# EAGLE design board (EAGLE 9.6.2)
Assembly variants: Assembly
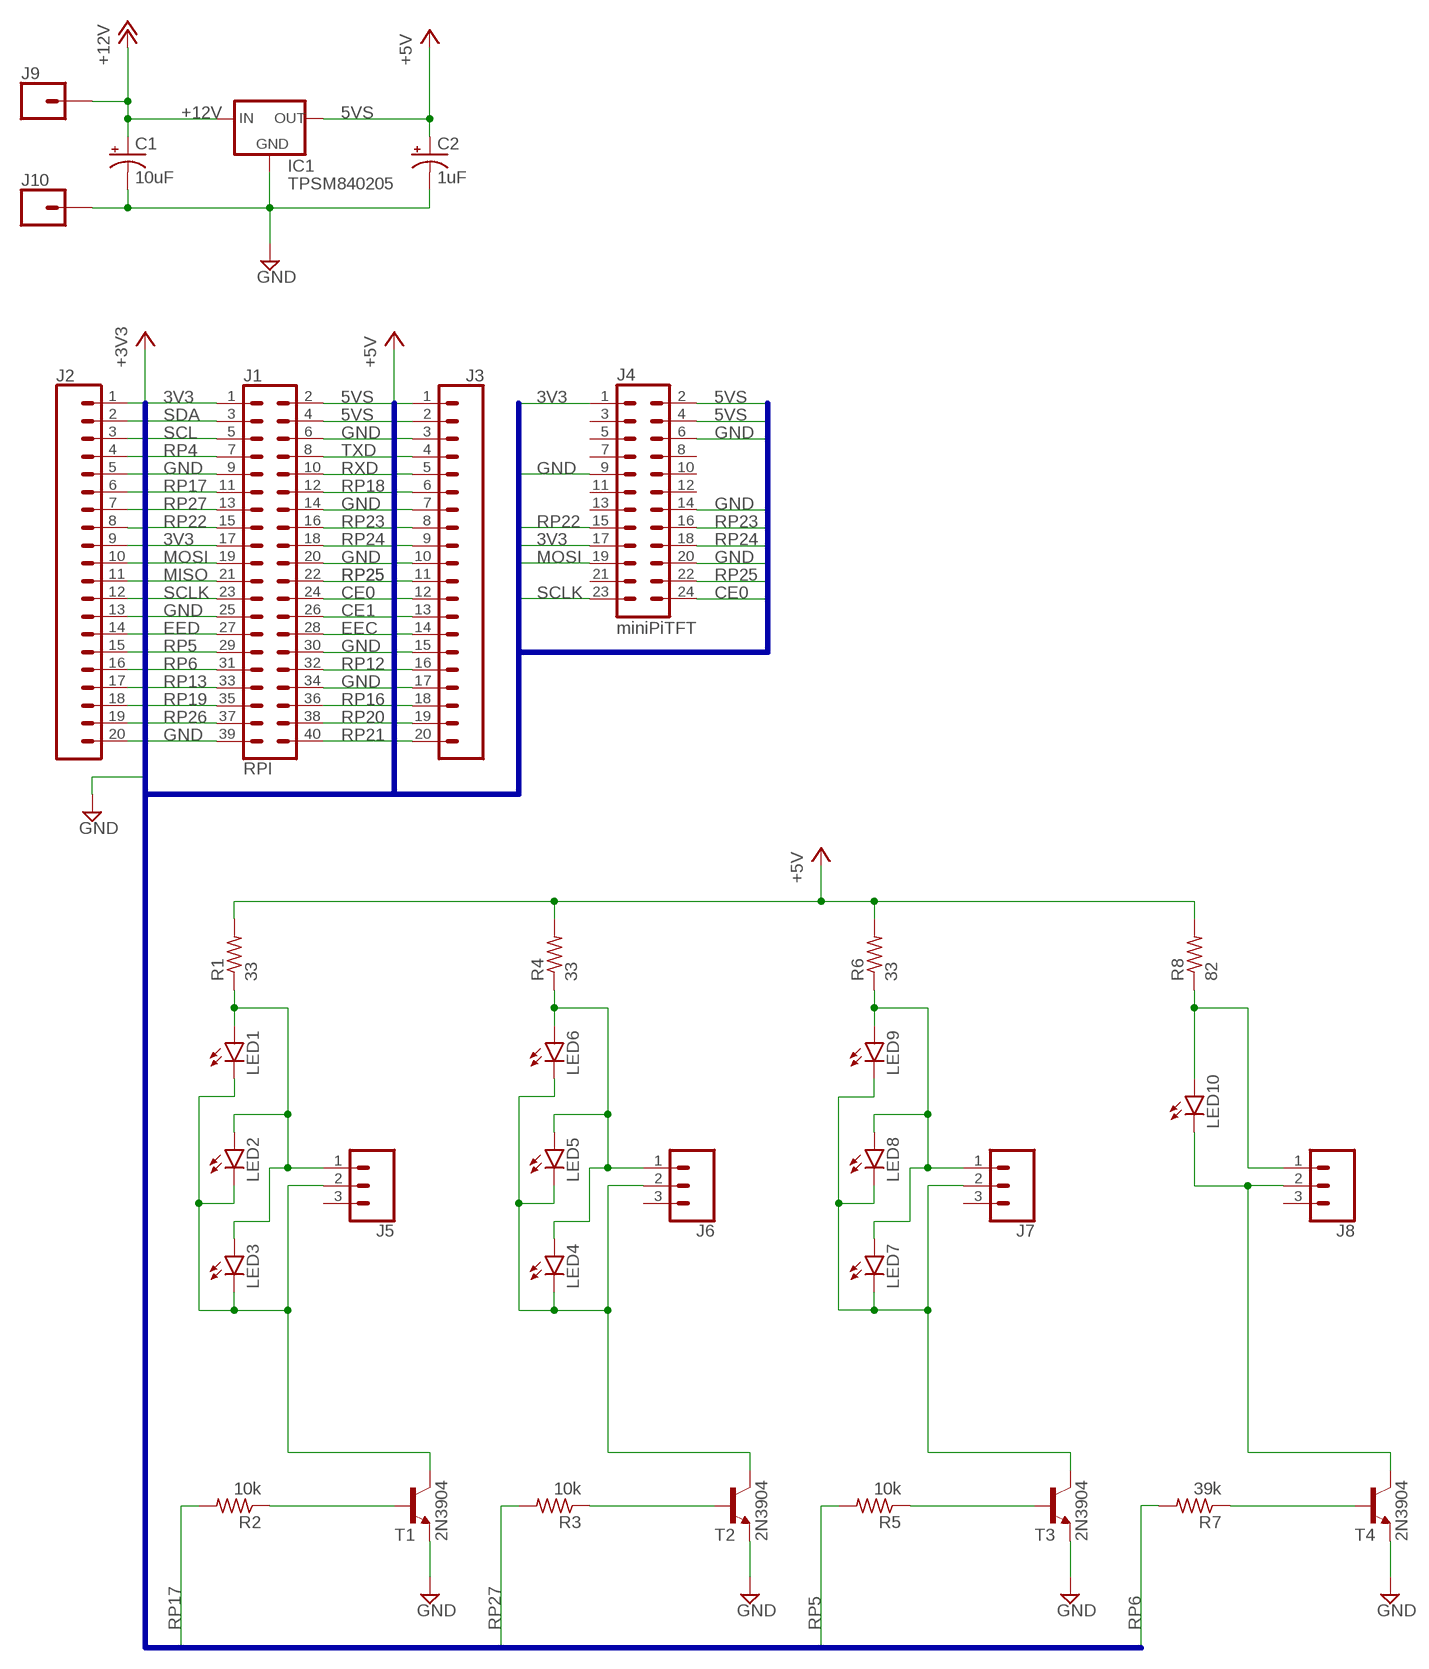
[diagram p0: schematic, sheet 1]

## Parts
C1  10uF  CPOL-USE2,5-6E  [E2,5-6E]
C2  1uF  CPOL-USE2,5-6E  [E2,5-6E]
IC1  TPSM840205  78XXS  [78XXS]
J1  RPI  CONN_20X2  [2X20]
J2  CONN_20  [1X20]
J3  CONN_20  [1X20]
J4  miniPiTFT  CONN_12X2  [2X12]
J5  CONN_03  [1X03]
J6  CONN_03  [1X03]
J7  CONN_03  [1X03]
J8  CONN_03  [1X03]
J9  CONN_01  [1X01]
J10  CONN_01  [1X01]
LED1  LED3MM  [LED3MM]  (not fitted in variant Assembly)
LED2  LED3MM  [LED3MM]  (not fitted in variant Assembly)
LED3  LED3MM  [LED3MM]  (not fitted in variant Assembly)
LED4  LED3MM  [LED3MM]  (not fitted in variant Assembly)
LED5  LED3MM  [LED3MM]  (not fitted in variant Assembly)
LED6  LED3MM  [LED3MM]  (not fitted in variant Assembly)
LED7  LED3MM  [LED3MM]  (not fitted in variant Assembly)
LED8  LED3MM  [LED3MM]  (not fitted in variant Assembly)
LED9  LED3MM  [LED3MM]  (not fitted in variant Assembly)
LED10  LED3MM  [LED3MM]  (not fitted in variant Assembly)
R1  33  R-US_0204/7  [0204/7]
R2  10k  R-US_0204/7  [0204/7]
R3  10k  R-US_0204/7  [0204/7]
R4  33  R-US_0204/7  [0204/7]
R5  10k  R-US_0204/7  [0204/7]
R6  33  R-US_0204/7  [0204/7]
R7  39k  R-US_0204/7  [0204/7]
R8  82  R-US_0204/7  [0204/7]
T1  2N3904  [TO92]
T2  2N3904  [TO92]
T3  2N3904  [TO92]
T4  2N3904  [TO92]

## Nets
3V3: J1.1 J1.17 J2.1 J2.9 J4.1 J4.17 ; supply symbol labelled +3V3
5VS: C2.+ IC1.OUT J1.2 J1.4 J3.1 J3.2 J4.2 J4.4 R1.2 R4.2 R6.2 R8.2 ; supply symbol labelled +5V
+12V: C1.+ IC1.IN J9.1
CE0: J1.24 J3.12 J4.24
CE1: J1.26 J3.13
EEC: J1.28 J3.14
EED: J1.27 J2.14
GND: C1.- C2.- IC1.GND J1.6 J1.9 J1.14 J1.20 J1.25 J1.30 J1.34 J1.39 J2.5 J2.13 J2.20 J3.3 J3.7 J3.10 J3.15 J3.17 J4.6 J4.9 J4.14 J4.20 J10.1 T1.3(E) T2.3(E) T3.3(E) T4.3(E)
MISO: J1.21 J2.11
MOSI: J1.19 J2.10 J4.19
N$1: J5.1 LED1.A LED2.A LED3.A R1.1
N$4: J5.2 LED1.K(C) LED2.K(C) LED3.K(C) T1.1(C)
N$5: R2.1 T1.2(B)
N$6: J6.2 LED4.K(C) LED5.K(C) LED6.K(C) T2.1(C)
N$13: R3.1 T2.2(B)
N$14: J6.1 LED4.A LED5.A LED6.A R4.1
N$15: R5.1 T3.2(B)
N$16: R7.1 T4.2(B)
N$24: J7.1 LED7.A LED8.A LED9.A R6.1
N$29: J7.2 LED7.K(C) LED8.K(C) LED9.K(C) T3.1(C)
N$39: J8.1 LED10.A R8.1
N$45: J8.2 LED10.K(C) T4.1(C)
RP4: J1.7 J2.4
RP5: J1.29 J2.15 R5.2
RP6: J1.31 J2.16 R7.2
RP12: J1.32 J3.16
RP13: J1.33 J2.17
RP16: J1.36 J3.18
RP17: J1.11 J2.6 R2.2
RP18: J1.12 J3.6
RP19: J1.35 J2.18
RP20: J1.38 J3.19
RP21: J1.40 J3.20
RP22: J1.15 J2.8 J4.15
RP23: J1.16 J3.8 J4.16
RP24: J1.18 J3.9 J4.18
RP25: J1.22 J3.11 J4.22
RP26: J1.37 J2.19
RP27: J1.13 J2.7 R3.2
RXD: J1.10 J3.5
SCL: J1.5 J2.3
SCLK: J1.23 J2.12 J4.23
SDA: J1.3 J2.2
TXD: J1.8 J3.4
Unconnected: J4.3 J4.5 J4.7 J4.8 J4.10 J4.11 J4.12 J4.13 J4.21 J5.3 J6.3 J7.3 J8.3

## Buses
RPI:3V3,5VS,CE[0..1],EEC,EED,GND,MISO,MOSI,RP[0..40],RXD,SCL,SCLK,SDA,TXD

## Library data of the parts
C1 C2 = rcl:CPOL-US: POLARIZED CAPACITOR, American symbol; SPICEPREFIX: C
IC1 = v-reg:78XXS: VOLTAGE REGULATOR
J1 = SparkFun-Connectors:CONN_20X2: Multi connection point. Often used as Generic Header-pin footprint for 0.1 inch spaced/style header connections On any of the 0.1 inch spaced packages, you can populate with these: Break Away Headers - Straight <https://www.sparkfun.com/products/116> (PRT-00116) Break Away Male Headers - Right Angle <https://www.sparkfun.com/products/553> (PRT-00553) Female Headers <https://www.sparkfun.com/products/115> (PRT-00115) Break Away Headers - Machine Pin <https://www.sparkfun.com/products/117> (PRT-00117) Break Away Female Headers - Swiss Machine Pin <https://www.sparkfun.com/products/743> (PRT-00743)
J2 J3 = SparkFun-Connectors:CONN_20: Multi connection point. Often used as Generic Header-pin footprint for 0.1 inch spaced/style header connections On any of the 0.1 inch spaced packages, you can populate with these: Break Away Headers - Straight <https://www.sparkfun.com/products/116> (PRT-00116) Break Away Male Headers - Right Angle <https://www.sparkfun.com/products/553> (PRT-00553) Female Headers <https://www.sparkfun.com/products/115> (PRT-00115) Break Away Headers - Machine Pin <https://www.sparkfun.com/products/117> (PRT-00117) Break Away Female Headers - Swiss Machine Pin <https://www.sparkfun.com/products/743> (PRT-00743) For SCREWTERMINALS and SPRING TERMINALS visit here: Screw Terimnals on SparkFun.com <https://www.sparkfun.com/search/results?term=Screw+Terminals> (5mm/3.5mm/2.54mm spacing) This device is also useful as a general connection point to wire up your design to another part of your project. Our various solder wires solder well into these plated through hole pads. Hook-Up Wire - Assortment (Stranded, 22 AWG) <https://www.sparkfun.com/products/11375> (PRT-11375) Hook-Up Wire - Assortment (Solid Core, 22 AWG) <https://www.sparkfun.com/products/11367> (PRT-11367) View the entire wire category on our website here <https://www.sparkfun.com/categories/141> Special notes: Molex polarized connector foot print use with SKU : PRT-08231 with associated crimp pins and housings. 1MM SMD Version SKU: PRT-10208 NOTES ON THE VARIANTS LOCK and LOCK_LONGPADS... This footprint was designed to help hold the alignment of a through-hole component (i.e. 6-pin header) while soldering it into place. You may notice that each hole has been shifted either up or down by 0.005 of an inch from it's more standard position (which is a perfectly straight line). This slight alteration caused the pins (the squares in the middle) to touch the edges of the holes. Because they are alternating, it causes a "brace" to hold the component in place. 0.005 has proven to be the perfect amount of "off-center" position when using our standard breakaway headers. Although looks a little odd when you look at the bare footprint, once you have a header in there, the alteration is very hard to notice. Also,if you push a header all the way into place, it is covered up entirely on the bottom side. Note about LOCK SPECIAL package: This is just like the LOCK variant in that the holes are staggared by 5 mil, but except for the last two holes. They are not altered from the "standard" footprint layout. This is used for a special purpose on the layout of our Graphic LCD Backpack. Make sure you want to use this device before selecting it for you project!
J4 = SparkFun-Connectors:CONN_12X2: Multi connection point. Often used as Generic Header-pin footprint for 0.1 inch spaced/style header connections On any of the 0.1 inch spaced packages, you can populate with these: Break Away Headers - Straight <https://www.sparkfun.com/products/116> (PRT-00116) Break Away Male Headers - Right Angle <https://www.sparkfun.com/products/553> (PRT-00553) Female Headers <https://www.sparkfun.com/products/115> (PRT-00115) Break Away Headers - Machine Pin <https://www.sparkfun.com/products/117> (PRT-00117) Break Away Female Headers - Swiss Machine Pin <https://www.sparkfun.com/products/743> (PRT-00743)
J5-J8 = SparkFun-Connectors:CONN_03: Multi connection point. Often used as Generic Header-pin footprint for 0.1 inch spaced/style header connections On any of the 0.1 inch spaced packages, you can populate with these: Break Away Headers - Straight <https://www.sparkfun.com/products/116> (PRT-00116) Break Away Male Headers - Right Angle <https://www.sparkfun.com/products/553> (PRT-00553) Female Headers <https://www.sparkfun.com/products/115> (PRT-00115) Break Away Headers - Machine Pin <https://www.sparkfun.com/products/117> (PRT-00117) Break Away Female Headers - Swiss Machine Pin <https://www.sparkfun.com/products/743> (PRT-00743) Stackable Header - 3 Pin (Female, 0.1") <https://www.sparkfun.com/products/13875> (PRT-13875) For SCREWTERMINALS and SPRING TERMINALS visit here: Screw Terimnals on SparkFun.com <https://www.sparkfun.com/search/results?term=Screw+Terminals> (5mm/3.5mm/2.54mm spacing) This device is also useful as a general connection point to wire up your design to another part of your project. Our various solder wires solder well into these plated through hole pads. Hook-Up Wire - Assortment (Stranded, 22 AWG) <https://www.sparkfun.com/products/11375> (PRT-11375) Hook-Up Wire - Assortment (Solid Core, 22 AWG) <https://www.sparkfun.com/products/11367> (PRT-11367) View the entire wire category on our website here <https://www.sparkfun.com/categories/141> Special notes: Molex polarized connector foot print use with SKU : PRT-08232 with associated crimp pins and housings.
J9 J10 = SparkFun-Connectors:CONN_01: Single connection point. Often used as Generic Header-pin footprint for 0.1 inch spaced/style header connections On any of the 0.1 inch spaced packages, you can populate with these: Break Away Headers - Straight <https://www.sparkfun.com/products/116> (PRT-00116) Break Away Male Headers - Right Angle <https://www.sparkfun.com/products/553> (PRT-00553) Female Headers <https://www.sparkfun.com/products/115> (PRT-00115) Break Away Headers - Machine Pin <https://www.sparkfun.com/products/117> (PRT-00117) Break Away Female Headers - Swiss Machine Pin <https://www.sparkfun.com/products/743> (PRT-00743) This device is also useful as a general connection point to wire up your design to another part of your project. Our various solder wires solder well into these plated through hole pads. Hook-Up Wire - Assortment (Stranded, 22 AWG) <https://www.sparkfun.com/products/11375> (PRT-11375) Hook-Up Wire - Assortment (Solid Core, 22 AWG) <https://www.sparkfun.com/products/11367> (PRT-11367) View the entire wire category on our website here <https://www.sparkfun.com/categories/141> Special notes: SMTSO-256-ET is a "flush mount" nut for a 4-40 screw. We mostly use this on specialty testbeds; it is a nice way to connect hardware to your PCB at an adjustable hieght. Also note, the SNAP packages are for using a snappable style connector. We sell a baggie of snaps and they are also used on two LilyPad designs: Snap Assortment - 30 pack (male and female) <https://www.sparkfun.com/products/11347> (DEV-11347) LilyPad Arduino SimpleSnap <https://www.sparkfun.com/products/10941> (DEV-10941) LilyPad SimpleSnap Protoboard <https://www.sparkfun.com/products/10940> (DEV-10940)
LED1-LED10 = led:LED: LED OSRAM: - CHIPLED LG R971, LG N971, LY N971, LG Q971, LY Q971, LO R971, LY R971 LH N974, LH R974 LS Q976, LO Q976, LY Q976 LO Q996 - Hyper CHIPLED LW Q18S LB Q993, LB Q99A, LB R99A - SideLED LS A670, LO A670, LY A670, LG A670, LP A670 LB A673, LV A673, LT A673, LW A673 LH A674 LY A675 LS A676, LA A676, LO A676, LY A676, LW A676 LS A679, LY A679, LG A679 - Hyper Micro SIDELED® LS Y876, LA Y876, LO Y876, LY Y876 LT Y87S - SmartLED LW L88C, LW L88S LB L89C, LB L89S, LG L890 LS L89K, LO L89K, LY L89K LS L896, LA L896, LO L896, LY L896 - TOPLED LS T670, LO T670, LY T670, LG T670, LP T670 LSG T670, LSP T670, LSY T670, LOP T670, LYG T670 LG T671, LOG T671, LSG T671 LB T673, LV T673, LT T673, LW T673 LH T674 LS T676, LA T676, LO T676, LY T676, LB T676, LH T676, LSB T676, LW T676 LB T67C, LV T67C, LT T67C, LS T67K, LO T67K, LY T67K, LW E67C LS E67B, LA E67B, LO E67B, LY E67B, LB E67C, LV E67C, LT E67C LW T67C LS T679, LY T679, LG T679 LS T770, LO T770, LY T770, LG T770, LP T770 LB T773, LV T773, LT T773, LW T773 LH T774 LS E675, LA E675, LY E675, LS T675 LS T776, LA T776, LO T776, LY T776, LB T776 LHGB T686 LT T68C, LB T68C - Hyper Mini TOPLED® LB M676 - Mini TOPLED Santana® LG M470 LS M47K, LO M47K, LY M47K Source: http://www.osram.convergy.de LUXEON: - LUMILED® LXK2-PW12-R00, LXK2-PW12-S00, LXK2-PW14-U00, LXK2-PW14-V00 LXK2-PM12-R00, LXK2-PM12-S00, LXK2-PM14-U00 LXK2-PE12-Q00, LXK2-PE12-R00, LXK2-PE12-S00, LXK2-PE14-T00, LXK2-PE14-U00 LXK2-PB12-K00, LXK2-PB12-L00, LXK2-PB12-M00, LXK2-PB14-N00, LXK2-PB14-P00, LXK2-PB14-Q00 LXK2-PR12-L00, LXK2-PR12-M00, LXK2-PR14-Q00, LXK2-PR14-R00 LXK2-PD12-Q00, LXK2-PD12-R00, LXK2-PD12-S00 LXK2-PH12-R00, LXK2-PH12-S00 LXK2-PL12-P00, LXK2-PL12-Q00, LXK2-PL12-R00 Source: www.luxeon.com KINGBRIGHT: KA-3528ASYC Source: www.kingbright.com
R1-R8 = rcl:R-US_: RESISTOR, American symbol; SPICEPREFIX: R
T1-T4 = transistor:2N3904: NPN TRANSISTOR

## Board
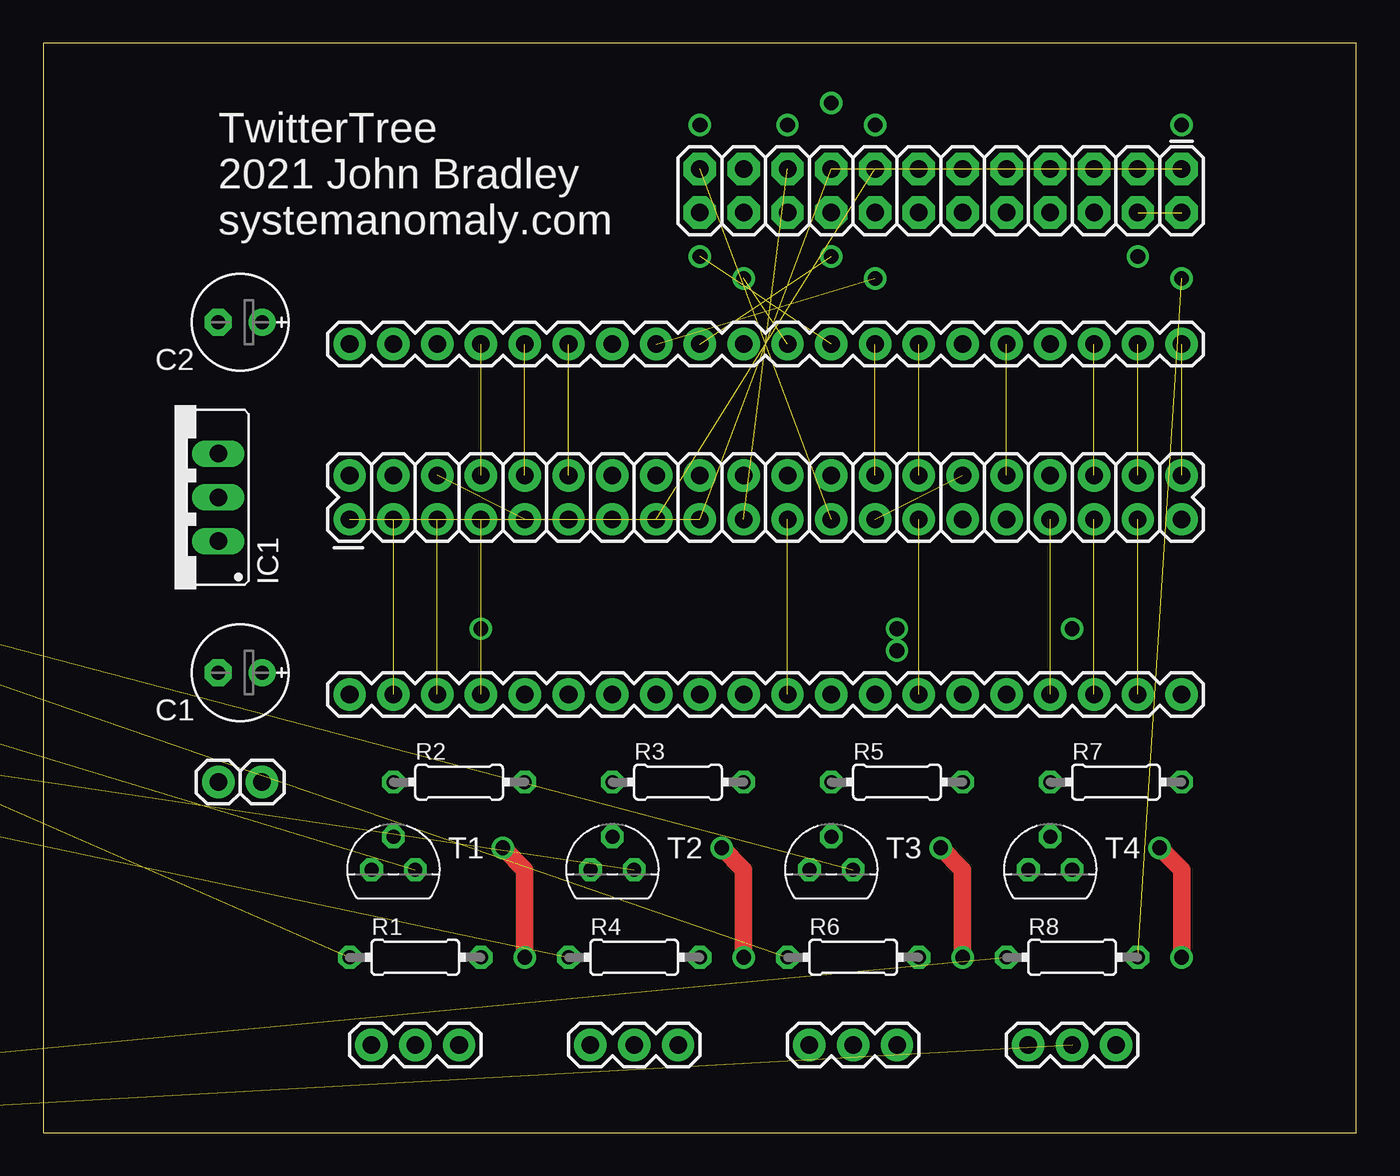
[diagram p1: board, top side]
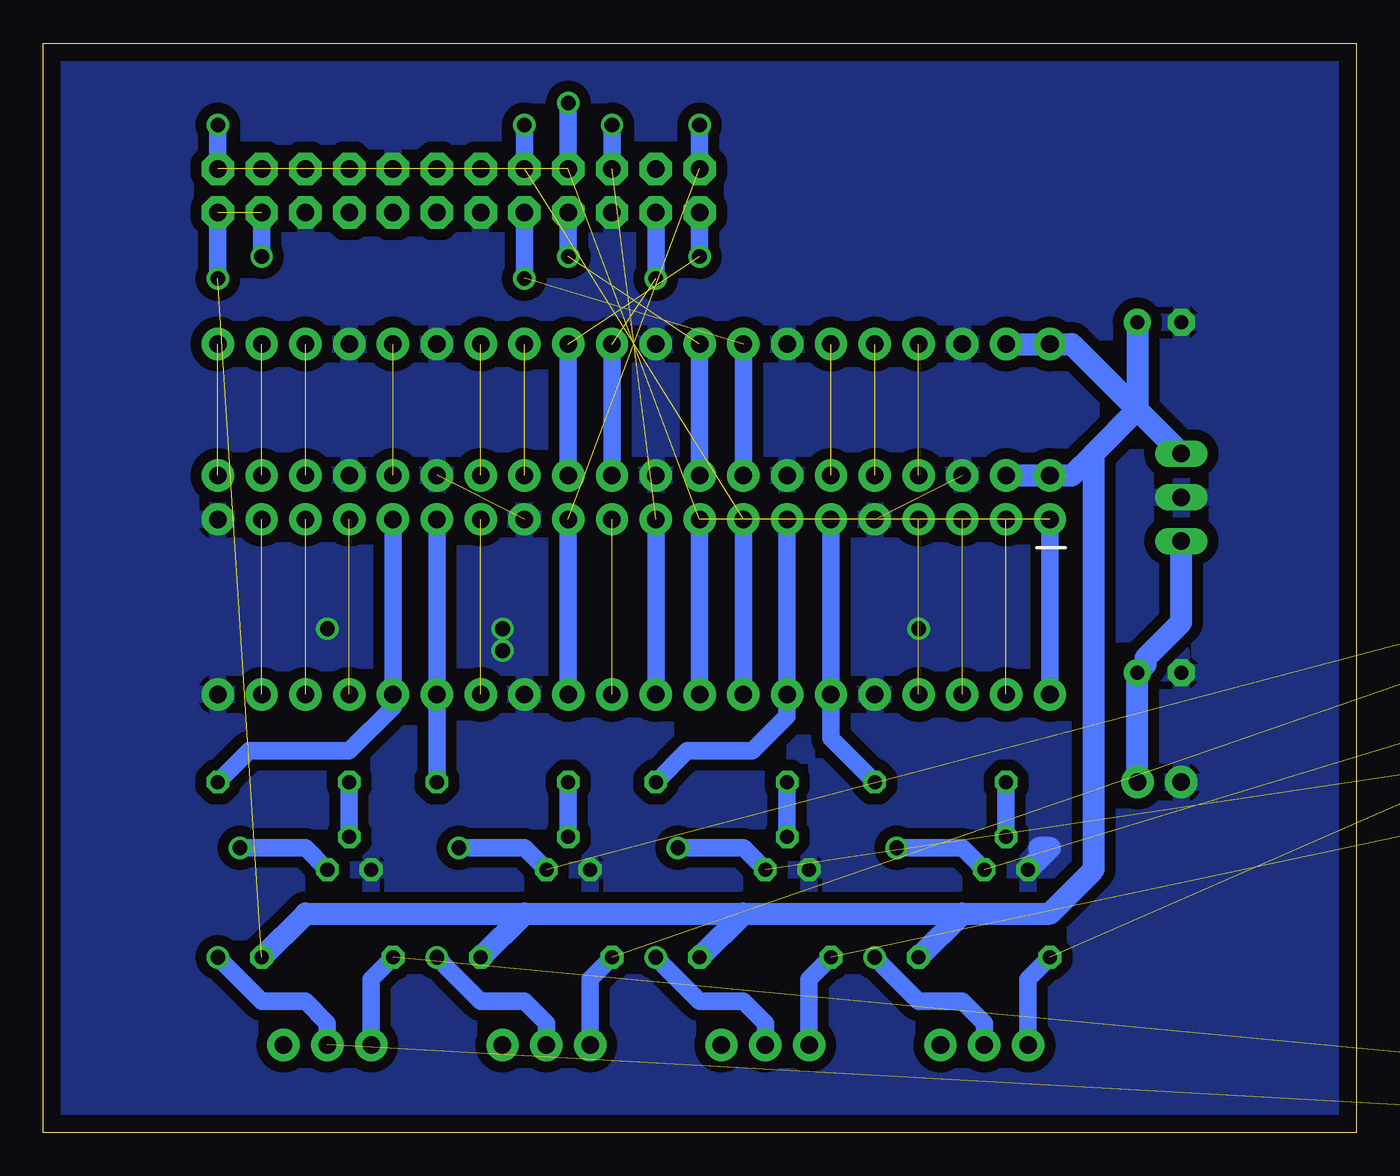
[diagram p2: board, bottom side, seen from below]

Size 76.18 x 63.17 mm. Coordinates in mm from the lower left corner, seen from the top.
Outline: 0,0 76.18,0 76.18,63.17 0,63.17 0,0
Copper layers (1*16): Top 0.035mm / dielectric 1.5mm / Bottom 0.035mm
Design rules "default *": minimum track width 6mil, minimum drill 0.35mm, track to track 25mil, track to pad 25mil, pad to pad 25mil, via to via 25mil, smd to smd 0mil, copper to edge 40mil, drill to drill 40mil, minimum pad ring 10mil, minimum via ring 8mil, stop-mask expansion 4mil, vias tented up to drill 0mil, thermal gap 10mil

### Footprints (pad centres in the part's own frame; a part is rotated, then mirrored left to right if it is on the bottom)
E2,5-6E = drill 0.813 pad 1.575: + -1.27,0 | drill 0.813 pad 1.575 octagon: - 1.27,0
78XXS = drill 1.016 long: GND 0,-2.54; IN -2.54,-2.54; OUT 2.54,-2.54
2X20 = drill 1.016 pad 1.88: 1 0,0; 2 0,2.54; 3 2.54,0; 4 2.54,2.54; 5 5.08,0; 6 5.08,2.54; 7 7.62,0; 8 7.62,2.54; 9 10.16,0; 10 10.16,2.54; 11 12.7,0; 12 12.7,2.54; 13 15.24,0; 14 15.24,2.54; 15 17.78,0; 16 17.78,2.54; 17 20.32,0; 18 20.32,2.54; 19 22.86,0; 20 22.86,2.54; 21 25.4,0; 22 25.4,2.54; 23 27.94,0; 24 27.94,2.54; 25 30.48,0; 26 30.48,2.54; 27 33.02,0; 28 33.02,2.54; 29 35.56,0; 30 35.56,2.54; 31 38.1,0; 32 38.1,2.54; 33 40.64,0; 34 40.64,2.54; 35 43.18,0; 36 43.18,2.54; 37 45.72,0; 38 45.72,2.54; 39 48.26,0; 40 48.26,2.54
1X20 = drill 1.016 pad 1.88: 1 0,0; 2 2.54,0; 3 5.08,0; 4 7.62,0; 5 10.16,0; 6 12.7,0; 7 15.24,0; 8 17.78,0; 9 20.32,0; 10 22.86,0; 11 25.4,0; 12 27.94,0; 13 30.48,0; 14 33.02,0; 15 35.56,0; 16 38.1,0; 17 40.64,0; 18 43.18,0; 19 45.72,0; 20 48.26,0
2X12 = drill 1.016 pad 1.88 octagon: 1 0,0; 2 0,2.54; 3 2.54,0; 4 2.54,2.54; 5 5.08,0; 6 5.08,2.54; 7 7.62,0; 8 7.62,2.54; 9 10.16,0; 10 10.16,2.54; 11 12.7,0; 12 12.7,2.54; 13 15.24,0; 14 15.24,2.54; 15 17.78,0; 16 17.78,2.54; 17 20.32,0; 18 20.32,2.54; 19 22.86,0; 20 22.86,2.54; 21 25.4,0; 22 25.4,2.54; 23 27.94,0; 24 27.94,2.54
1X03 = drill 1.016 pad 1.88: 1 0,0; 2 2.54,0; 3 5.08,0
1X01 = drill 1.016 pad 1.88: 1 0,0
LED3MM = drill 0.813 octagon: A -1.27,0; K 1.27,0
0204/7 = drill 0.813 octagon: 1 -3.81,0; 2 3.81,0
TO92 = drill 0.813 octagon: 1 1.27,0; 2 0,1.905; 3 -1.27,0

### Placement (x,y rotation side)
C1  11.43,26.67 180 top
C2  11.43,46.99 180 top
IC1  7.62,36.83 90 top
J1  17.78,35.56 0 top
J2  17.78,25.4 0 top
J3  17.78,45.72 0 top
J4  66.04,55.88 180 top
J5  19.05,5.08 0 top
J6  31.75,5.08 0 top
J7  44.45,5.08 0 top
J8  57.15,5.08 0 top
J9  12.7,20.32 0 top
J10  10.16,20.32 0 top
LED1  -21.59,27.94 0 top  (outside the outline)
LED2  -31.75,27.94 0 top  (outside the outline)
LED3  -41.91,27.94 0 top  (outside the outline)
LED4  -52.07,27.94 0 top  (outside the outline)
LED5  -62.23,27.94 0 top  (outside the outline)
LED6  -72.39,27.94 0 top  (outside the outline)
LED7  -21.59,33.02 0 top  (outside the outline)
LED8  -31.75,33.02 0 top  (outside the outline)
LED9  -41.91,33.02 0 top  (outside the outline)
LED10  -77.47,-2.54 0 top  (outside the outline)
R1  21.59,10.16 0 top
R2  24.13,20.32 0 top
R3  36.83,20.32 0 top
R4  34.29,10.16 0 top
R5  49.53,20.32 0 top
R6  46.99,10.16 0 top
R7  62.23,20.32 0 top
R8  59.69,10.16 0 top
T1  20.32,15.24 0 top
T2  33.02,15.24 0 top
T3  45.72,15.24 0 top
T4  58.42,15.24 0 top

### Tracks (layer width: path | path; a pad name or v marks a point on that pad's centre or on a via)
3V3  (via drill 0.85 pad 1.3)  (3 unrouted)
  Bottom 1.016: J4.1 v66.04,58.42 | J4.17 v45.72,59.69 | J2.1 J1.1 | J2.9 J1.17
5VS  (via drill 0.85 pad 1.3)  (2 unrouted)
  Bottom 1.016: J4.4 v63.5,50.8 | J4.2 v66.04,49.53
  Bottom 1.27: C2.+ 12.7,41.91 | 12.7,41.91 IC1.OUT | J1.4 J1.2 16.51,38.1 15.24,39.37 | 15.24,39.37 12.7,41.91 | J3.2 J3.1 16.51,45.72 12.7,41.91 | R8.2 60.96,12.7 48.26,12.7 | 15.24,39.37 15.24,15.24 17.78,12.7 22.86,12.7 | 48.26,12.7 35.56,12.7 | 35.56,12.7 22.86,12.7 | R1.2 22.86,12.7 | R4.2 35.56,12.7 | R6.2 48.26,12.7
+12V
  Bottom 1.27: J9.1 C1.+ 12.22,27.15 12.22,27.52 10.16,29.58 IC1.IN
CE0  (via drill 0.85 pad 1.3)  (1 unrouted)
  Bottom 1.016: J4.24 v38.1,50.8 | J3.12 J1.24
CE1  (1 unrouted)
EEC  (1 unrouted)
EED  (1 unrouted)
GND  (via drill 0.85 pad 1.3)  (2 unrouted)
  Bottom 1.27: T1.3 17.78,16.51 18.39,16.51
  other vias: 25.4,29.21 49.53,29.21 49.53,27.94 59.69,29.21
  pour Bottom: 1.27,1.27 1.27,62.23 74.93,62.23 74.93,1.27
MISO  (1 unrouted)
MOSI  (via drill 0.85 pad 1.3)  (1 unrouted)
  Bottom 1.016: J4.19 v43.18,58.42 | J2.10 J1.19
N$1  (3 unrouted)
  Bottom 1.016: R1.1 19.05,8.89 J5.1
N$4  (via drill 0.85 pad 1.3)  (3 unrouted)
  Top 1.016: v26.67,16.51 27.94,15.24 v27.94,10.16
  Bottom 1.016: T1.1 22.86,16.51 v26.67,16.51 | v27.94,10.16 27.2,9.42 27.2,9.41 25.41,7.62 22.86,7.62 21.59,6.35 J5.2
N$5
  Bottom 1.016: R2.1 T1.2
N$6  (via drill 0.85 pad 1.3)  (3 unrouted)
  Top 1.016: v39.37,16.51 40.64,15.24 v40.64,10.16
  Bottom 1.016: T2.1 35.56,16.51 v39.37,16.51 | v40.64,10.16 39.9,9.42 39.9,9.41 38.11,7.62 35.56,7.62 34.29,6.35 J6.2
N$13
  Bottom 1.016: R3.1 T2.2
N$14  (3 unrouted)
  Bottom 1.016: R4.1 31.75,8.89 J6.1
N$15
  Bottom 1.016: R5.1 T3.2
N$16
  Bottom 1.016: R7.1 T4.2
N$24  (3 unrouted)
  Bottom 1.016: R6.1 44.45,8.89 J7.1
N$29  (via drill 0.85 pad 1.3)  (3 unrouted)
  Top 1.016: v52.07,16.51 53.34,15.24 v53.34,10.16
  Bottom 1.016: T3.1 48.26,16.51 v52.07,16.51 | v53.34,10.16 52.6,9.42 52.6,9.41 50.81,7.62 48.26,7.62 46.99,6.35 J7.2
N$39  (1 unrouted)
  Bottom 1.016: R8.1 57.15,8.89 J8.1
N$45  (via drill 0.85 pad 1.3)  (1 unrouted)
  Top 1.016: v64.77,16.51 66.04,15.24 v66.04,10.16
  Bottom 1.016: T4.1 60.96,16.51 v64.77,16.51 | v66.04,10.16 65.3,9.42 65.3,9.41 63.51,7.62 60.96,7.62 59.69,6.35 J8.2
RP4  (1 unrouted)
RP5
  Bottom 1.016: R5.2 J2.15 J1.29
RP6
  Bottom 1.016: R7.2 64.24,22.12 58.42,22.12 55.88,24.66 J2.16 J1.31
RP12  (1 unrouted)
RP13  (1 unrouted)
RP16  (1 unrouted)
RP17
  Bottom 1.016: R2.2 30.48,22.86 J2.6 J1.11
RP18  (1 unrouted)
RP19  (1 unrouted)
RP20  (1 unrouted)
RP21  (1 unrouted)
RP22  (via drill 0.85 pad 1.3)  (1 unrouted)
  Bottom 1.016: J4.15 v48.26,58.42 | J2.8 J1.15
RP23  (via drill 0.85 pad 1.3)  (1 unrouted)
  Bottom 1.016: J4.16 v48.26,49.53 | J1.16 J3.8
RP24  (via drill 0.85 pad 1.3)  (1 unrouted)
  Bottom 1.016: J4.18 v45.72,50.8 | J3.9 J1.18
RP25  (via drill 0.85 pad 1.3)  (1 unrouted)
  Bottom 1.016: J4.22 v40.64,49.53 | J1.22 J3.11
RP26  (1 unrouted)
RP27
  Bottom 1.016: R3.2 38.84,22.12 35.03,22.12 33.02,24.13 J2.7 J1.13
RXD  (1 unrouted)
SCL  (1 unrouted)
SCLK  (via drill 0.85 pad 1.3)  (1 unrouted)
  Bottom 1.016: J4.23 v38.1,58.42 | J2.12 J1.23
SDA  (1 unrouted)
TXD  (1 unrouted)

### Text on the board
tNames: TwitterTree / 2021 John Bradley / systemanomaly.com
tValues: 5V | 5V | GND | TXD | RXD | 18 | GND | 23 | 24 | GND | 25 | CE0 | CE1 | EEC | GND | 12 | GND | 16 | 20 | 21 | 3V3 | SDA | SCL | 4 | GND | 17 | 27 | 22 | 3V3 | MOSI | MSIO | SCLK | GND | EED | 5 | 6 | 13 | 19 | 26 | GND | GND | 12v